# Altium project STC15F104_IR_RelayControl.PrjPCB
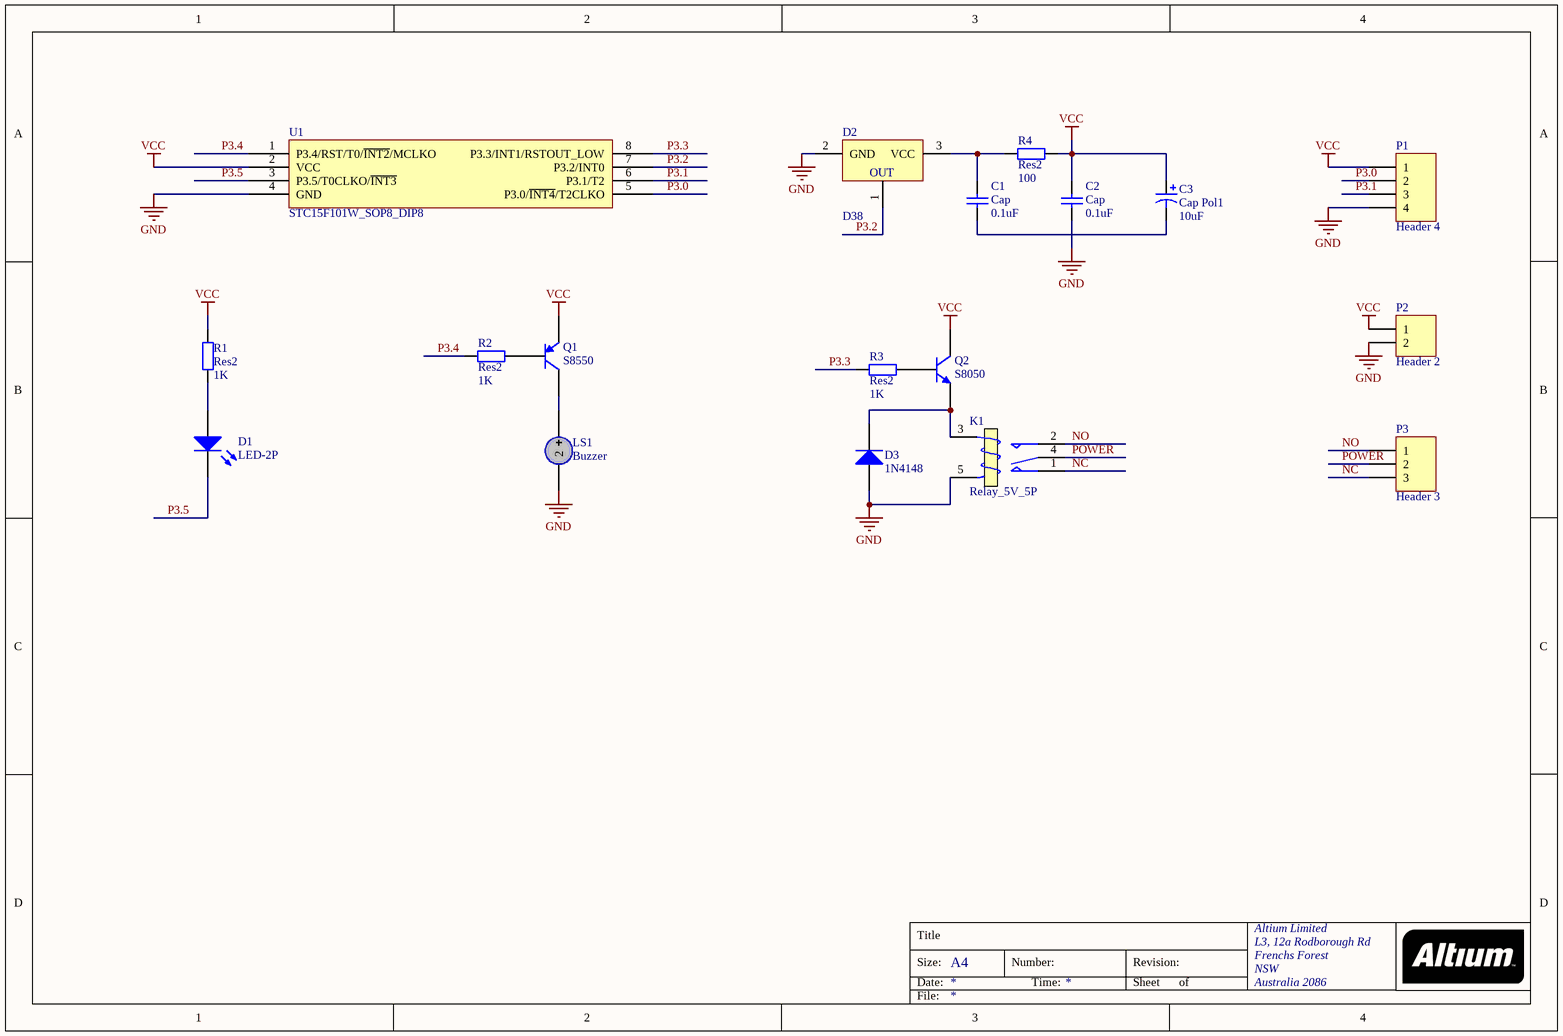
[diagram p0: STC15F104_IR_RelayControl.SchDoc]
1 sheet, 18 parts. Net scope: global (net labels, ports and power ports of the same name join across sheets).
Board file: STC15F104_IR_RelayControl.PcbDoc

## Sheet STC15F104_IR_RelayControl.SchDoc
size A4; Organization: Altium Limited; Address1: L3, 12a Rodborough Rd; Address2: Frenchs Forest; Address3: NSW; Address4: Australia 2086

### Parts
C1  Cap  value 0.1uF  [0805]
C2  Cap  value 0.1uF  [0805]
C3  Cap Pol1  value 10uF  [C1206A]
D1  LED-2P  [C0805]
D2  D38  [D1838-H3]
D3  1N4148  [C1206A]
K1  Relay_5V_5P  [RELAY_5V_5P]
LS1  Buzzer  [Buzzer]
P1  Header 4  [HDR1X4]
P2  Header 2  [KF301-2P]
P3  Header 3  [KF301-3P]
Q1  S8550  [TO92]
Q2  S8050  [TO92]
R1  Res2  value 1K  [0805]
R2  Res2  value 1K  [0805]
R3  Res2  value 1K  [0805]
R4  Res2  value 100  [0805]
U1  STC15F101W_SOP8_DIP8  [DIP8_SOP8]

### Nets
GND: C2.2 D2.2(GND) D3.1(A) K1.5(T2) LS1.2 P1.4 P2.2 U1.4(GND)
VCC: C2.1 C3.1 P1.1 P2.1 Q1.1(E) Q2.3(C) R1.1 R4.1 U1.2(VCC)
NC: K1.1(NO) P3.3
NO: K1.2(NC) P3.1
P3.0: P1.2 U1.5(P3.0/~{INT4}/T2CLKO)
P3.1: P1.3 U1.6(P3.1/T2)
P3.2: D2.1(OUT) U1.7(P3.2/INT0)
P3.3: R3.2 U1.8(P3.3/INT1/RSTOUT_LOW)
P3.4: R2.2 U1.1(P3.4/RST/T0/~{INT2}/MCLKO)
P3.5: D1.2(K) U1.3(P3.5/T0CLKO/~{INT3})
POWER: K1.4(COM) P3.2
NetC1_1: C1.1 D2.3(VCC) R4.2
NetC1_2: C1.2 C3.2
NetD1_1: D1.1(A) R1.2
NetD3_2: D3.2(K) K1.3(T1) Q2.1(E)
NetLS1_1: LS1.1 Q1.3(C)
NetQ1_2: Q1.2(B) R2.1
NetQ2_2: Q2.2(B) R3.1

### Notes on the sheet
- Title
- Size:
- Date:
- A4
- Number:
- Time:
- Revision:
- Sheet
- of
- File:

### Library data of the parts
C1 C2 = Cap: Capacitor; Published: 8-Jun-2000; LatestRevisionDate: 17-Jul-2002; LatestRevisionNote: Re-released for DXP Platform.; PackageReference: RAD-0.3; Publisher: Altium Limited; PackageDescription: Radial Cap, Thru-Hole; 2 Leads; 0.3 in Pin Spacing
C3 = Cap Pol1: Polarized Capacitor (Radial); Published: 8-Jun-2000; LatestRevisionDate: 17-Jul-2002; LatestRevisionNote: Re-released for DXP Platform.; PackageReference: RB7.6-15; Publisher: Altium Limited; PackageDescription: Polarized Capacitor (Radial); 2 Leads
D1 = LED-2P: 发光二极管
D2 = D38: 一体化万能接收头
D3 = 1N4148: 快速开关二极管
K1 = Relay_5V_5P: 继电器
LS1 = Buzzer: 蜂鸣
P1 = Header 4: Header, 4-Pin; LatestRevisionDate: 17-Jul-2002; LatestRevisionNote: Re-released for DXP Platform.; Publisher: Altium Limited
P2 = Header 2: Header, 2-Pin; LatestRevisionDate: 17-Jul-2002; LatestRevisionNote: Re-released for DXP Platform.; Publisher: Altium Limited
P3 = Header 3: Header, 3-Pin; LatestRevisionDate: 17-Jul-2002; LatestRevisionNote: Re-released for DXP Platform.; Publisher: Altium Limited
Q1 = S8550: PNP 三极管
Q2 = S8050: NPN 三极管
R1-R4 = Res2: Resistor; Published: 8-Jun-2000; LatestRevisionDate: 17-Jul-2002; LatestRevisionNote: Re-released for DXP Platform.; PackageReference: AXIAL-0.4; Publisher: Altium Limited; PackageDescription: Axial Device, Thru-Hole; 2 Leads; 0.4 in Pin Spacing